# Altium schematic sheet RH100.SchDoc
size A4; SheetNumber: 8; SheetTotal: 14
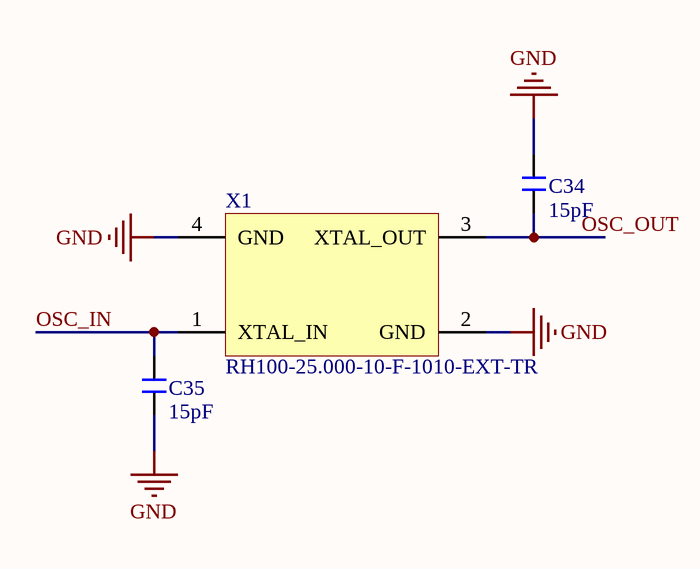
[diagram p0: RH100.SchDoc]

## Parts
C34  value 15pF  [402 capacitor - duplicate]  (hidden comment: 0402 capacitor)
C35  value 15pF  [402 capacitor - duplicate]  (hidden comment: 0402 capacitor)
X1  RH100-25.000-10-F-1010-EXT-TR  [RH100-25.000-10-F-1010-EXT-TR]

## Nets
GND: C34.1 C35.1 X1.2(GND) X1.4(GND)
OSC_IN: C35.2 X1.1(XTAL_IN)
OSC_OUT: C34.2 X1.3(XTAL_OUT)

## Library data of the parts
C34 C35 = CAP SMD 402: MPN: GRM1555C1H150JA01D; Package: 0402
X1 = RH100-25.000-10-F-1010-EXT-TR: CRYSTAL 25.0000MHZ 10PF SMD; MPN: RH100-25.000-10-F-1010-EXT-TR